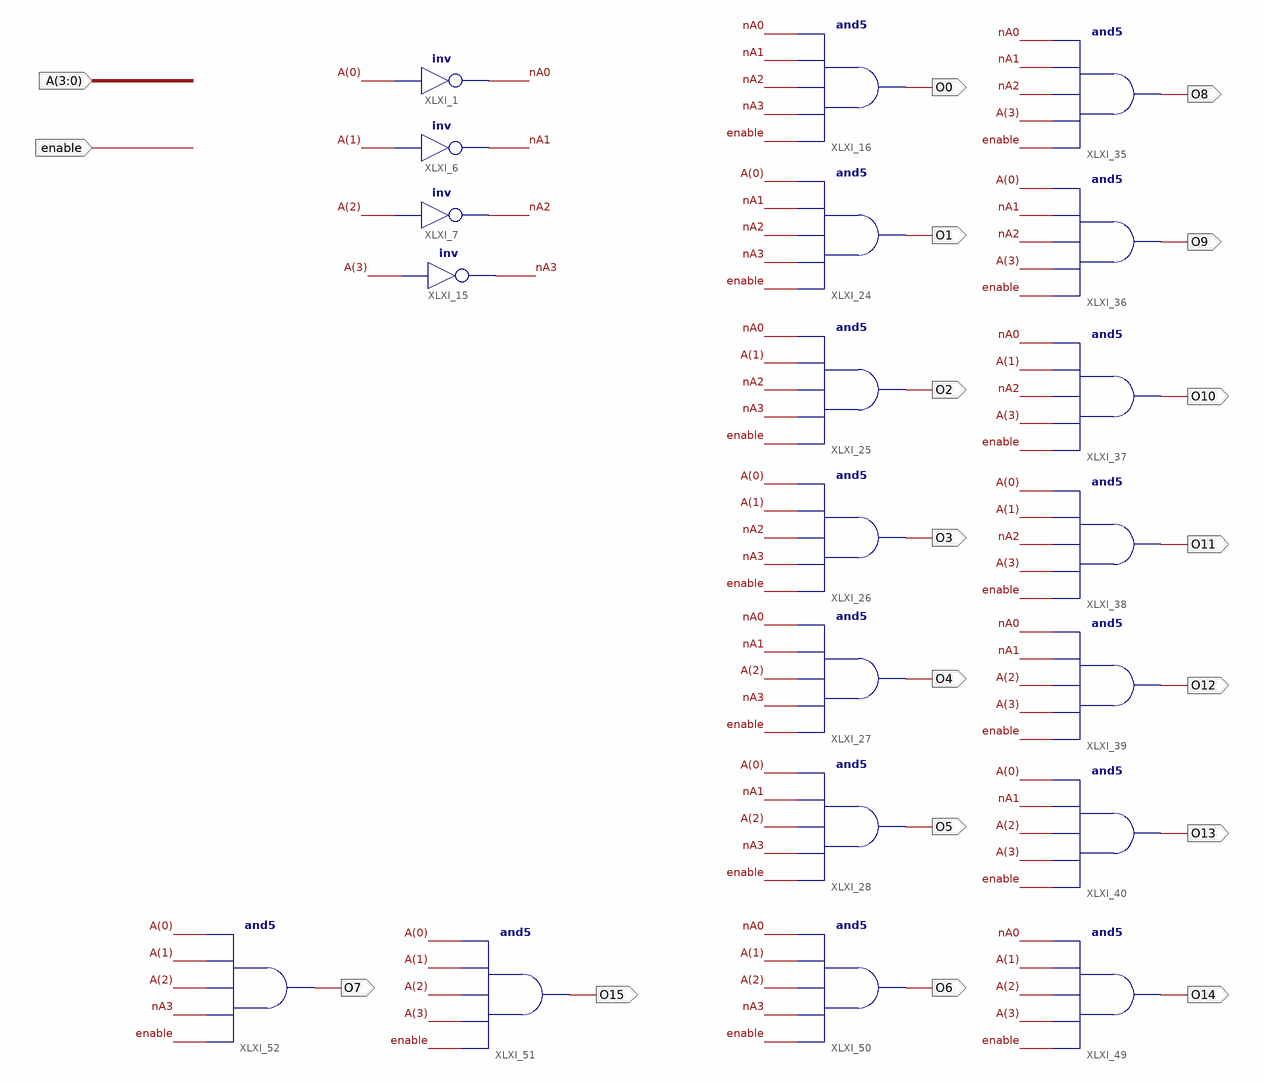
[diagram p0: schematic sheet 1]
// Xilinx ISE schematic decode3b8.sch (spartan3e) as structural Verilog: 20 symbols, 18 ports
module decode3b8 (
  input  [3:0] A,
  input  enable,
  output O0,
  output O1,
  output O2,
  output O3,
  output O4,
  output O5,
  output O8,
  output O9,
  output O10,
  output O11,
  output O12,
  output O13,
  output O6,
  output O14,
  output O7,
  output O15
);

  wire nA0, nA1, nA2, nA3;

  not XLXI_1 (nA0, A[0]);
  not XLXI_6 (nA1, A[1]);
  not XLXI_7 (nA2, A[2]);
  not XLXI_15 (nA3, A[3]);
  and XLXI_16 (O0, enable, nA3, nA2, nA1, nA0);
  and XLXI_24 (O1, enable, nA3, nA2, nA1, A[0]);
  and XLXI_25 (O2, enable, nA3, nA2, A[1], nA0);
  and XLXI_26 (O3, enable, nA3, nA2, A[1], A[0]);
  and XLXI_27 (O4, enable, nA3, A[2], nA1, nA0);
  and XLXI_28 (O5, enable, nA3, A[2], nA1, A[0]);
  and XLXI_35 (O8, enable, A[3], nA2, nA1, nA0);
  and XLXI_36 (O9, enable, A[3], nA2, nA1, A[0]);
  and XLXI_37 (O10, enable, A[3], nA2, A[1], nA0);
  and XLXI_38 (O11, enable, A[3], nA2, A[1], A[0]);
  and XLXI_39 (O12, enable, A[3], A[2], nA1, nA0);
  and XLXI_40 (O13, enable, A[3], A[2], nA1, A[0]);
  and XLXI_49 (O14, enable, A[3], A[2], A[1], nA0);
  and XLXI_50 (O6, enable, nA3, A[2], A[1], nA0);
  and XLXI_51 (O15, enable, A[3], A[2], A[1], A[0]);
  and XLXI_52 (O7, enable, nA3, A[2], A[1], A[0]);
endmodule
